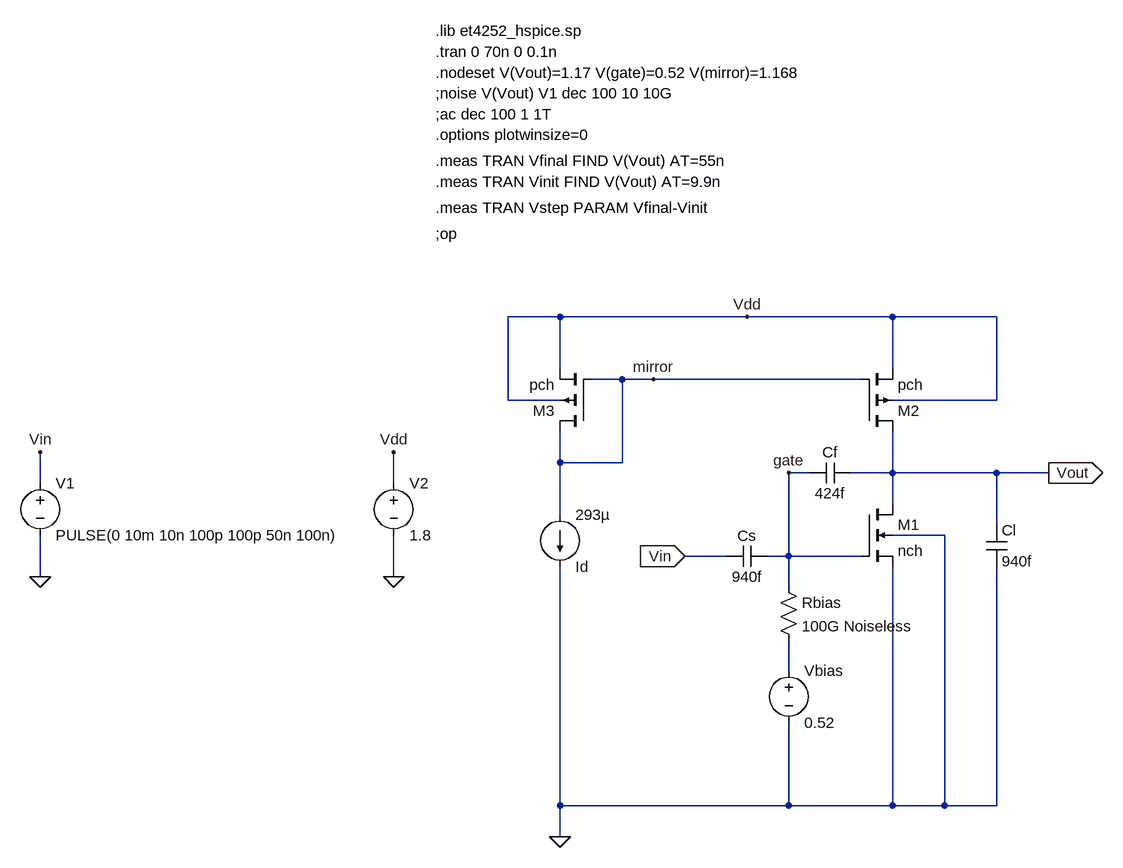
[diagram p0: schematic igs_pmos_load.asc]
igs_pmos_load.asc, the LTspice schematic file:
Version 4
SHEET 1 1408 976
WIRE 544 96 464 96
WIRE 832 96 544 96
WIRE 1056 96 832 96
WIRE 1216 96 1056 96
WIRE 544 176 544 96
WIRE 1056 176 1056 96
WIRE 640 192 592 192
WIRE 688 192 640 192
WIRE 1008 192 688 192
WIRE 464 224 464 96
WIRE 544 224 464 224
WIRE 1216 224 1216 96
WIRE 1216 224 1056 224
WIRE 544 320 544 272
WIRE 640 320 640 192
WIRE 640 320 544 320
WIRE 928 336 896 336
WIRE 1056 336 1056 272
WIRE 1056 336 992 336
WIRE 1216 336 1056 336
WIRE 1296 336 1216 336
WIRE -256 352 -256 304
WIRE 288 352 288 304
WIRE 1056 384 1056 336
WIRE 544 400 544 320
WIRE 1216 416 1216 336
WIRE 1136 432 1056 432
WIRE 800 464 736 464
WIRE 896 464 896 336
WIRE 896 464 864 464
WIRE 1008 464 896 464
WIRE -256 496 -256 432
WIRE 288 496 288 432
WIRE 896 512 896 464
WIRE 896 640 896 592
WIRE 544 848 544 480
WIRE 896 848 896 720
WIRE 896 848 544 848
WIRE 1056 848 1056 480
WIRE 1056 848 896 848
WIRE 1136 848 1136 432
WIRE 1136 848 1056 848
WIRE 1216 848 1216 480
WIRE 1216 848 1136 848
WIRE 544 896 544 848
FLAG 736 464 Vin
IOPIN 736 464 In
FLAG 832 96 Vdd
FLAG 544 896 0
FLAG -256 496 0
FLAG 288 496 0
FLAG -256 304 Vin
FLAG 288 304 Vdd
FLAG 1296 336 Vout
IOPIN 1296 336 Out
FLAG 896 336 gate
FLAG 688 192 mirror
DATAFLAG 1216 336 ""
DATAFLAG 896 464 ""
DATAFLAG 544 368 ""
DATAFLAG 816 192 ""
SYMBOL nmos4 1008 384 R0
SYMATTR InstName M1
SYMATTR Value nch
SYMATTR SpiceLine W=94.76u L=0.2u
SYMBOL pmos4 1008 272 M180
SYMATTR InstName M2
SYMATTR Value pch
SYMATTR SpiceLine W=179.92u L=0.9u
SYMBOL pmos4 592 272 R180
SYMATTR InstName M3
SYMATTR Value pch
SYMATTR SpiceLine W=179.92u L=0.9u
SYMBOL cap 1200 416 R0
SYMATTR InstName Cl
SYMATTR Value 940f
SYMBOL cap 992 320 R90
WINDOW 0 0 32 VBottom 2
WINDOW 3 32 32 VTop 2
SYMATTR InstName Cf
SYMATTR Value 424f
SYMBOL cap 864 448 R90
WINDOW 0 0 32 VBottom 2
WINDOW 3 32 32 VTop 2
SYMATTR InstName Cs
SYMATTR Value 940f
SYMBOL current 544 400 R0
WINDOW 0 24 80 Left 2
WINDOW 3 24 0 Left 2
WINDOW 123 0 0 Left 0
WINDOW 39 0 0 Left 0
SYMATTR InstName Id
SYMATTR Value 293µ
SYMBOL voltage -256 336 R0
SYMATTR InstName V1
SYMATTR Value PULSE(0 10m 10n 100p 100p 50n 100n)
SYMATTR Value2 AC 1
SYMBOL voltage 288 336 R0
SYMATTR InstName V2
SYMATTR Value 1.8
SYMBOL voltage 896 624 R0
WINDOW 123 0 0 Left 0
WINDOW 39 24 124 Left 2
SYMATTR InstName Vbias
SYMATTR Value 0.52
SYMBOL res 880 496 R0
SYMATTR InstName Rbias
SYMATTR Value 100G Noiseless
TEXT 352 -344 Left 2 !.lib et4252_hspice.sp
TEXT 352 -312 Left 2 !.tran 0 70n 0 0.1n
TEXT 352 -280 Left 2 !.nodeset V(Vout)=1.17 V(gate)=0.52 V(mirror)=1.168
TEXT 352 -248 Left 2 !;noise V(Vout) V1 dec 100 10 10G
TEXT 352 -216 Left 2 !;ac dec 100 1 1T
TEXT 352 -184 Left 2 !.options plotwinsize=0
TEXT 352 -144 Left 2 !.meas TRAN Vfinal FIND V(Vout) AT=55n
TEXT 352 -112 Left 2 !.meas TRAN Vinit FIND V(Vout) AT=9.9n
TEXT 352 -72 Left 2 !.meas TRAN Vstep PARAM Vfinal-Vinit
TEXT 352 -32 Left 2 !;op

The netlist it stands for:
* igs_pmos_load.asc
M1 Vout gate 0 0 nch W=94.76u L=0.2u
M2 Vout mirror Vdd Vdd pch W=179.92u L=0.9u
M3 mirror mirror Vdd Vdd pch W=179.92u L=0.9u
Cl Vout 0 940f
Cf Vout gate 424f
Cs gate Vin 940f
Id mirror 0 293µ
V1 Vin 0 PULSE(0 10m 10n 100p 100p 50n 100n) AC 1
V2 Vdd 0 1.8
Vbias N001 0 0.52
Rbias gate N001 100G Noiseless
.model NMOS NMOS
.model PMOS PMOS
.lib standard.mos
.lib et4252_hspice.sp
.tran 0 70n 0 0.1n
.nodeset V(Vout)=1.17 V(gate)=0.52 V(mirror)=1.168
;noise V(Vout) V1 dec 100 10 10G
;ac dec 100 1 1T
.options plotwinsize=0
.meas TRAN Vfinal FIND V(Vout) AT=55n
.meas TRAN Vinit FIND V(Vout) AT=9.9n
.meas TRAN Vstep PARAM Vfinal-Vinit
;op
.backanno
.end